# EAGLE design wakeel125 (EAGLE 7.5.0)
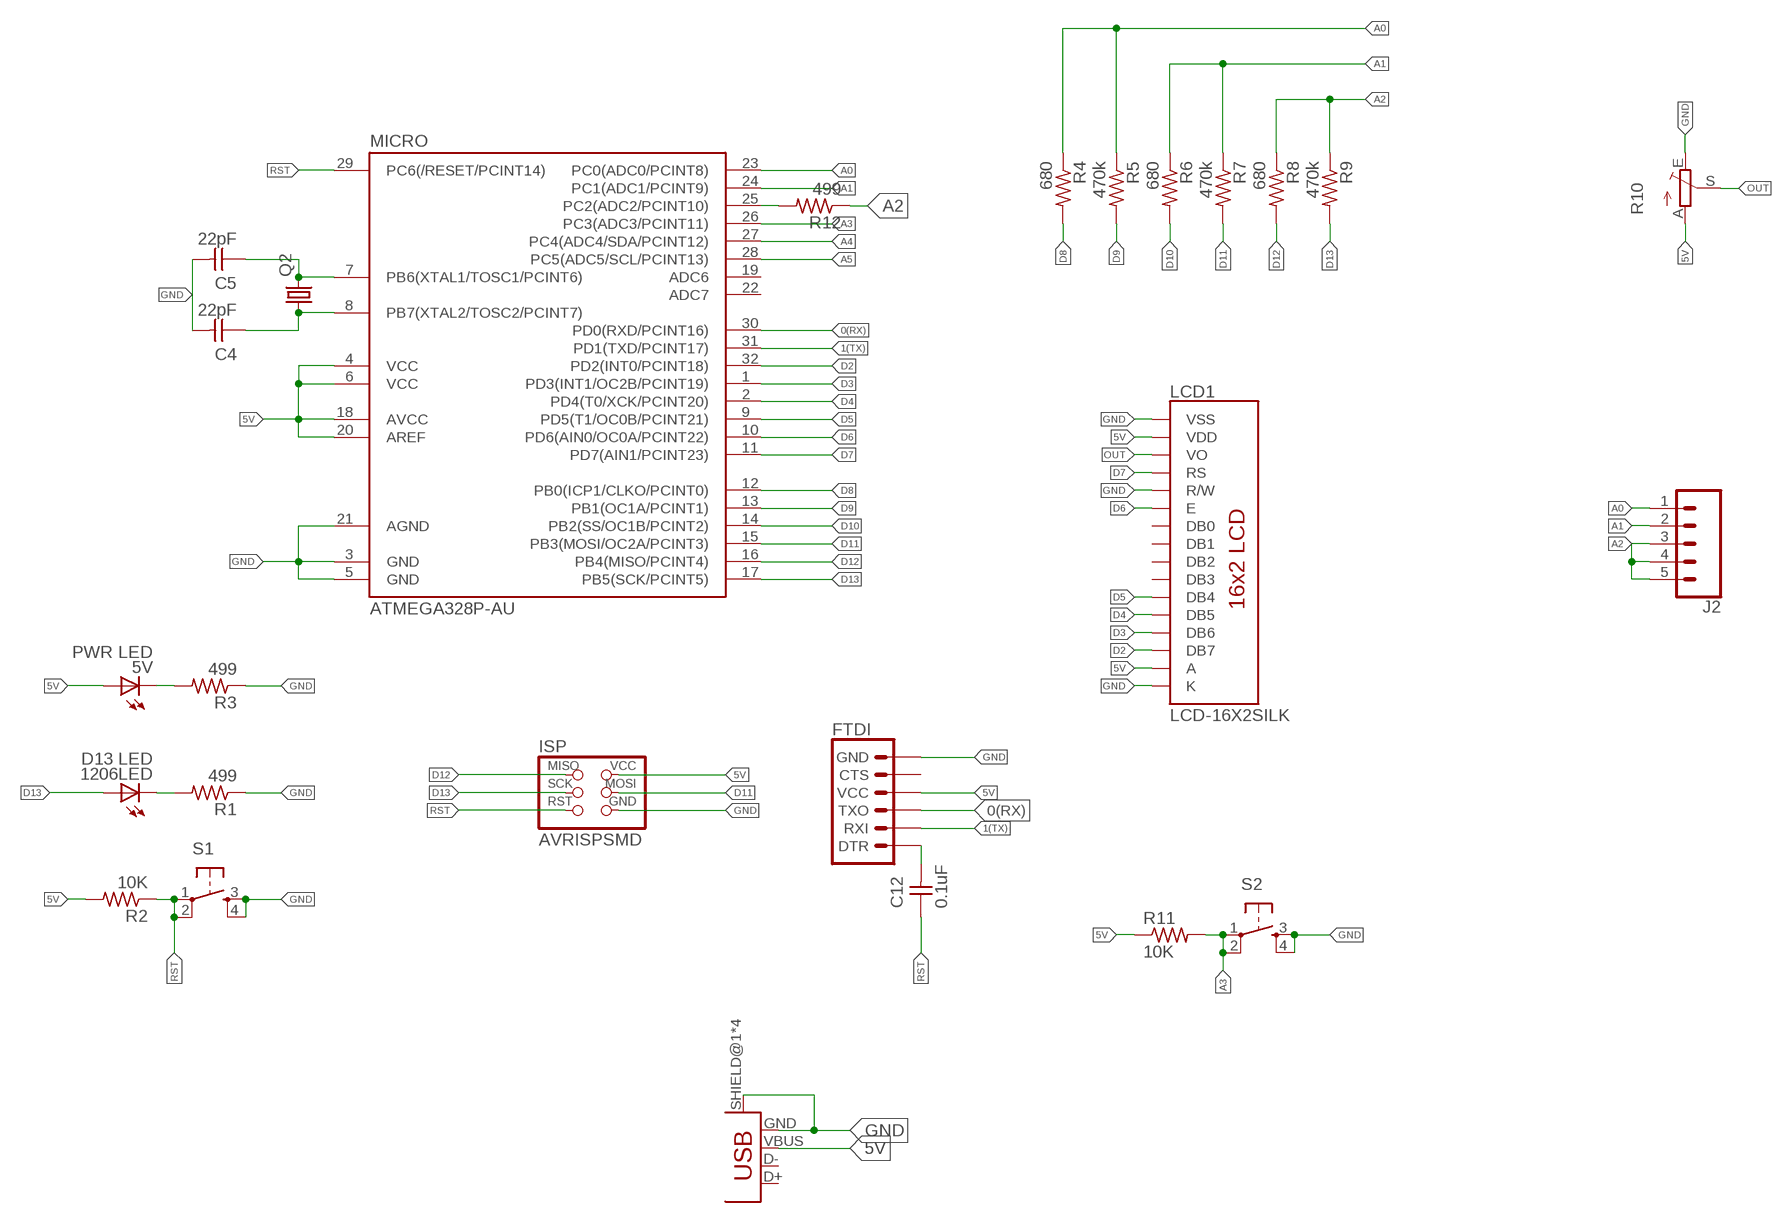
[diagram p0: schematic, sheet 1]

## Parts
5V  PWR LED  LEDFAB1206  [LED1206FAB]
1206LED  D13 LED  LEDFAB1206  [LED1206FAB]
C4  22pF  CAP-UNPOLARIZEDFAB  [C1206FAB]
C5  22pF  CAP-UNPOLARIZEDFAB  [C1206FAB]
C12  0.1uF  CAP-UNPOLARIZEDFAB  [C1206FAB]
CN1  USB_MINIB  [USB_MINIB]
FTDI  6_PIN_SERIAL_TARGET_SILK  [1X06]
ISP  AVRISPSMD  [2X03SMD]
J2  CONN_05  [1X05]
LCD1  LCD-16X2SILK  [LCD-16X2]
MICRO  ATMEGA328P-AU  ATMEGA48/88/168-AU  [TQFP32-08]
Q2  CRYSTALHC49U70  [HC49U70]
R1  499  RES-US1206FAB  [R1206FAB]
R2  10K  RES-US1206FAB  [R1206FAB]
R3  499  RES-US1206FAB  [R1206FAB]
R4  680  RES-US1206FAB  [R1206FAB]
R5  470k  RES-US1206FAB  [R1206FAB]
R6  680  RES-US1206FAB  [R1206FAB]
R7  470k  RES-US1206FAB  [R1206FAB]
R8  680  RES-US1206FAB  [R1206FAB]
R9  470k  RES-US1206FAB  [R1206FAB]
R10  TRIM_EU-B64W  [B64W]
R11  10K  RES-US1206FAB  [R1206FAB]
R12  499  RES-US1206FAB  [R1206FAB]
S1  6MM_SWITCH6MM_SWITCH  [6MM_SWITCH]
S2  6MM_SWITCH6MM_SWITCH  [6MM_SWITCH]

## Nets
0(RX): FTDI.3(TXO) MICRO.30(PD0(RXD/PCINT16))
1(TX): FTDI.2(RXI) MICRO.31(PD1(TXD/PCINT17))
5V: 5V.1(A) CN1.VBUS FTDI.4(VCC) ISP.2(VCC) LCD1.2(VDD) LCD1.15(A) MICRO.4(VCC) MICRO.6(VCC) MICRO.18(AVCC) MICRO.20(AREF) R2.2 R10.A R11.1
A0: J2.1 MICRO.23(PC0(ADC0/PCINT8)) R4.1 R5.1
A1: J2.2 MICRO.24(PC1(ADC1/PCINT9)) R6.1 R7.1
A2: J2.3 J2.4 J2.5 R8.1 R9.1 R12.1
A3: MICRO.26(PC3(ADC3/PCINT11)) R11.2 S2.1(P) S2.2(P1)
A4: MICRO.27(PC4(ADC4/SDA/PCINT12))
A5: MICRO.28(PC5(ADC5/SCL/PCINT13))
D2: LCD1.14(DB7) MICRO.32(PD2(INT0/PCINT18))
D3: LCD1.13(DB6) MICRO.1(PD3(INT1/OC2B/PCINT19))
D4: LCD1.12(DB5) MICRO.2(PD4(T0/XCK/PCINT20))
D5: LCD1.11(DB4) MICRO.9(PD5(T1/OC0B/PCINT21))
D6: LCD1.6(E) MICRO.10(PD6(AIN0/OC0A/PCINT22))
D7: LCD1.4(RS) MICRO.11(PD7(AIN1/PCINT23))
D8: MICRO.12(PB0(ICP1/CLKO/PCINT0)) R4.2
D9: MICRO.13(PB1(OC1A/PCINT1)) R5.2
D10: MICRO.14(PB2(SS/OC1B/PCINT2)) R6.2
D11: ISP.4(MOSI) MICRO.15(PB3(MOSI/OC2A/PCINT3)) R7.2
D12: ISP.1(MISO) MICRO.16(PB4(MISO/PCINT4)) R8.2
D13: 1206LED.1(A) ISP.3(SCK) MICRO.17(PB5(SCK/PCINT5)) R9.2
GND: C4.2 C5.2 CN1.GND CN1.SHIELD@1(SHIELD) CN1.SHIELD@2(SHIELD) CN1.SHIELD@3(SHIELD) CN1.SHIELD@4(SHIELD) FTDI.6(GND) ISP.6(GND) LCD1.1(VSS) LCD1.5(R/W) LCD1.16(K) MICRO.3(GND) MICRO.5(GND) MICRO.21(AGND) R1.1 R3.1 R10.E S1.3(S) S1.4(S1) S2.3(S) S2.4(S1)
N$1: 1206LED.2(C) R1.2
N$2: 5V.2(C) R3.2
N$3: C5.1 MICRO.7(PB6(XTAL1/TOSC1/PCINT6)) Q2.2
N$4: C4.1 MICRO.8(PB7(XTAL2/TOSC2/PCINT7)) Q2.1
N$5: MICRO.25(PC2(ADC2/PCINT10)) R12.2
N$16: C12.2 FTDI.1(DTR)
OUT: LCD1.3(VO) R10.S
RST: C12.1 ISP.5(RST) MICRO.29(PC6(/RESET/PCINT14)) R2.1 S1.1(P) S1.2(P1)
Unconnected: CN1.D+ CN1.D- FTDI.5(CTS) LCD1.7(DB0) LCD1.8(DB1) LCD1.9(DB2) LCD1.10(DB3) MICRO.19(ADC6) MICRO.22(ADC7)

## Library data of the parts
5V 1206LED = fab:LED: LED
C4 C5 C12 = fab:CAP-UNPOLARIZED
CN1 = fab:USB_MINIB
FTDI = SparkFun-Connectors:6_PIN_SERIAL_TARGET: 6-pin header connection for use with the "FTDI BASIC" pinout - TARGET SIDE. Also known as "Arduino Serial Program Header". It is used to mate with our FTDI Basic serial programmers using the Arduino IDE. Note, this device has "TARGET" in the name. It is intended to be used on a design that contains a target micro-controller that you wish to program. The "sister" device, named "CABLE" is inteneded to be used on a design that usually lives on the end of your USB cable and prvides the converter chip (FTDI232 or FTDI231x) to commnicate serial RX/TX. You can populate with some of these: Break Away Headers - Straight <https://www.sparkfun.com/products/116> (PRT-00116) For reference (or to suit your programming needs) check out these designs: SparkFun FTDI Basic Breakout - 5V <https://www.sparkfun.com/products/9716> (DEV-09716) SparkFun FTDI Basic Breakout - 3.3V <https://www.sparkfun.com/products/9873> (DEV-09873) SparkFun FTDI SmartBasic <https://www.sparkfun.com/products/12935> (DEV-12935) SparkFun Beefy 3 - FTDI Basic Breakout <https://www.sparkfun.com/products/13746> (DEV-13746)
ISP = fab:AVRISP
J2 = SparkFun-Connectors:CONN_05: Multi connection point. Often used as Generic Header-pin footprint for 0.1 inch spaced/style header connections On any of the 0.1 inch spaced packages, you can populate with these: Break Away Headers - Straight <https://www.sparkfun.com/products/116> (PRT-00116) Break Away Male Headers - Right Angle <https://www.sparkfun.com/products/553> (PRT-00553) Female Headers <https://www.sparkfun.com/products/115> (PRT-00115) Break Away Headers - Machine Pin <https://www.sparkfun.com/products/117> (PRT-00117) Break Away Female Headers - Swiss Machine Pin <https://www.sparkfun.com/products/743> (PRT-00743) For SCREWTERMINALS and SPRING TERMINALS visit here: Screw Terimnals on SparkFun.com <https://www.sparkfun.com/search/results?term=Screw+Terminals> (5mm/3.5mm/2.54mm spacing) This device is also useful as a general connection point to wire up your design to another part of your project. Our various solder wires solder well into these plated through hole pads. Hook-Up Wire - Assortment (Stranded, 22 AWG) <https://www.sparkfun.com/products/11375> (PRT-11375) Hook-Up Wire - Assortment (Solid Core, 22 AWG) <https://www.sparkfun.com/products/11367> (PRT-11367) View the entire wire category on our website here <https://www.sparkfun.com/categories/141> Special notes: Molex polarized connector foot print use with SKU : PRT-08231 with associated crimp pins and housings. 1MM SMD Version SKU: PRT-10208
LCD1 = SparkFun-Displays:LCD-16X2: Standard text-only 16x2 parallel input LCD Basic 16 character by 2 line display. Typically utilizes the extremely common HD44780 parallel interface chipset SparkFun Products: Basic 16x2 Green <https://www.sparkfun.com/products/255> Basic 8x2 Green <https://www.sparkfun.com/products/11122>; SF_ID: LCD-00255
MICRO = atmega8:ATMEGA48/88/168
Q2 = crystal:CRYSTAL: CRYSTAL; OC_FARNELL: unknown; OC_NEWARK: unknown
R1-R9 R11 R12 = fab:RES-US: Resistor (US Symbol) Variants with postfix FAB are widened to allow the routing of internal traces
R10 = pot:TRIM_EU-: POTENTIOMETER
S1 S2 = fab:6MM_SWITCH: OMRON SWITCH

## Board
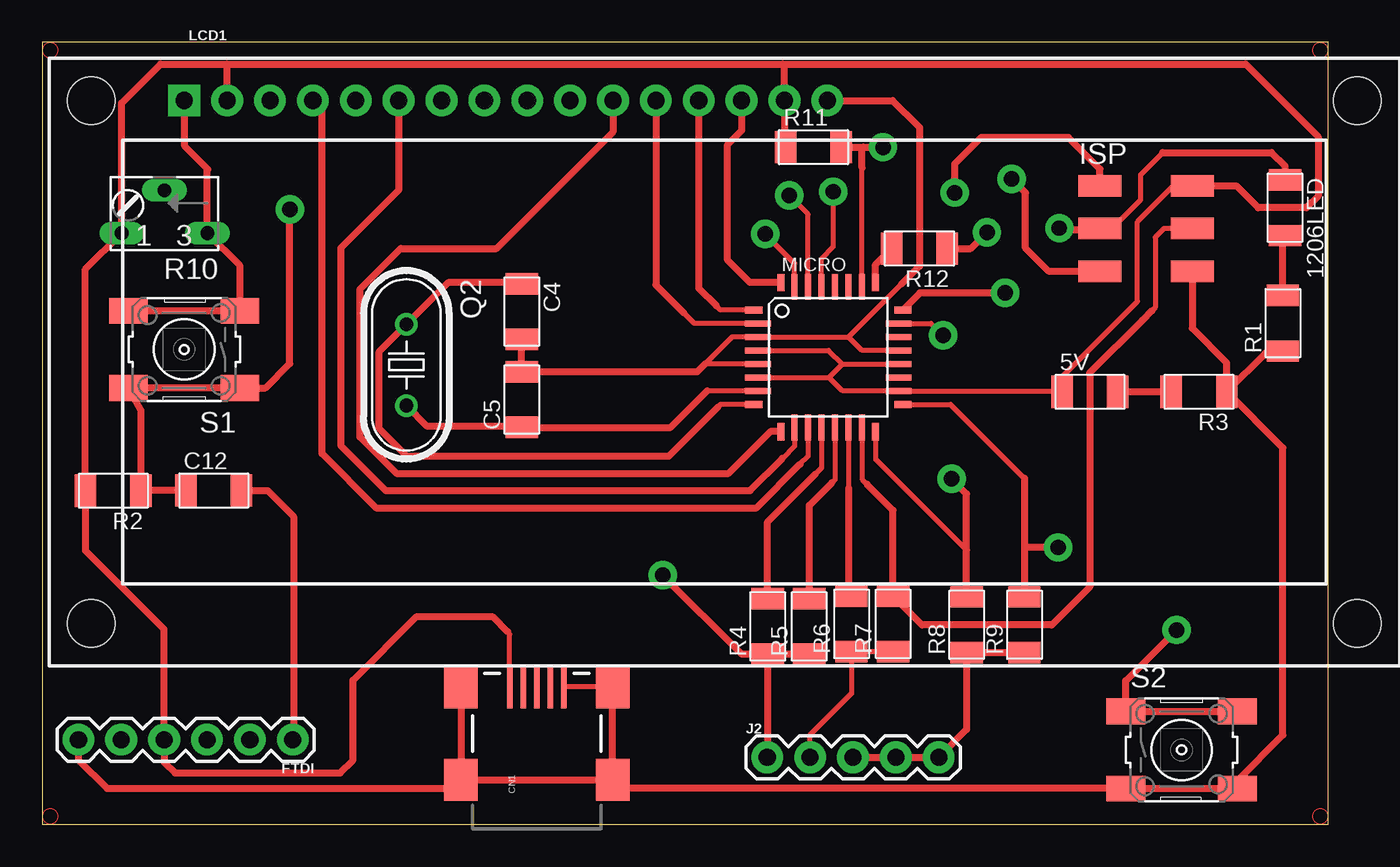
[diagram p1: board, top side]
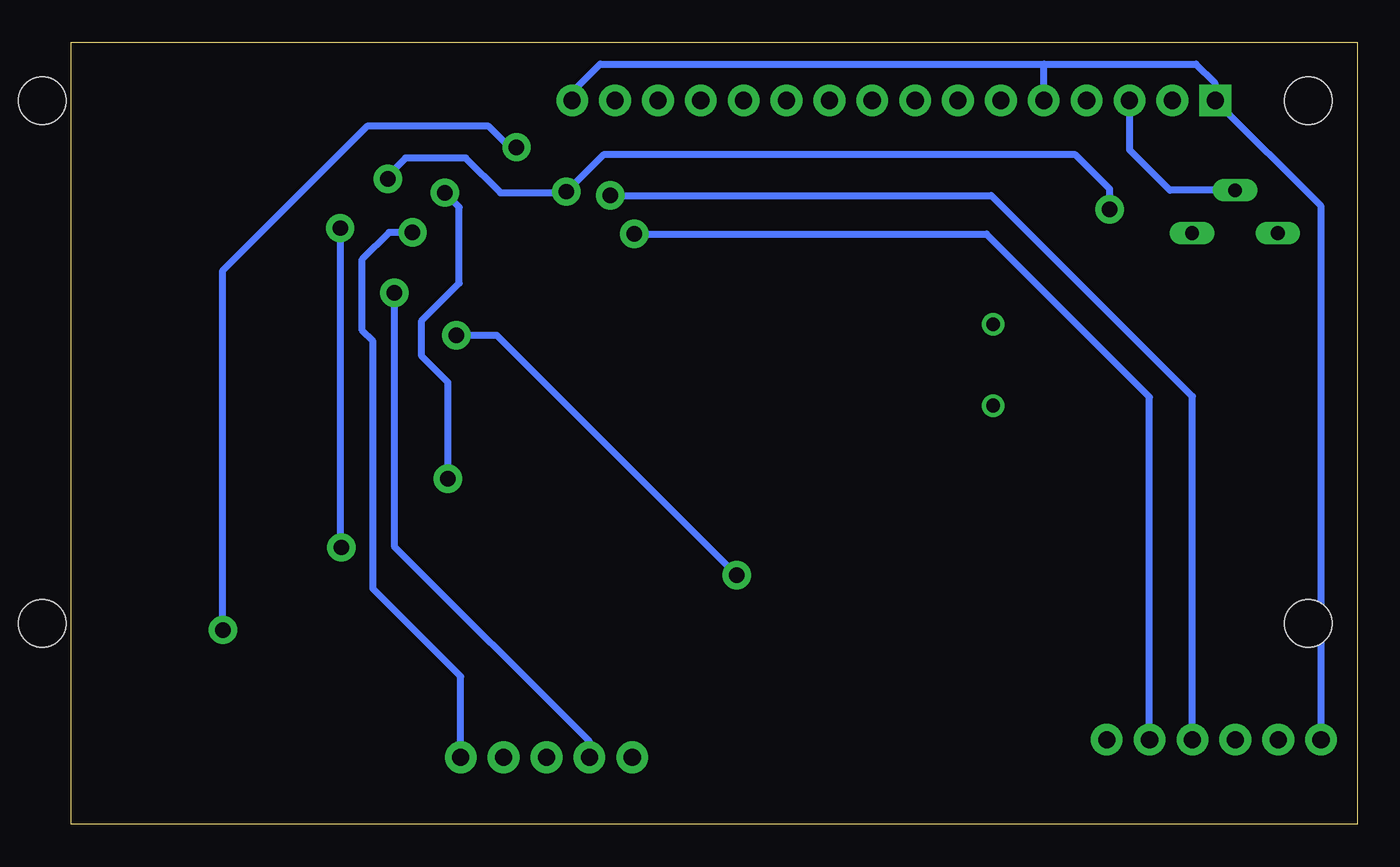
[diagram p2: board, bottom side, seen from below]

Size 76.2 x 46.35 mm. Coordinates in mm from the lower left corner, seen from the top.
Outline: 0,0 76.2,0 76.2,46.35 0,46.35 0,0
Copper layers (1*16): Top 0.035mm / dielectric 1.5mm / Bottom 0.035mm
Design rules "default *": minimum track width 10mil, minimum drill 24mil, track to track 12mil, track to pad 12mil, pad to pad 12mil, via to via 12mil, smd to smd 12mil, copper to edge 40mil, drill to drill 8mil, minimum pad ring 10mil, minimum via ring 8mil, stop-mask expansion 4mil, vias tented up to drill 0mil, thermal gap 10mil

### Footprints (pad centres in the part's own frame; a part is rotated, then mirrored left to right if it is on the bottom)
LED1206FAB = smd 1.27 x 1.905: 1 -1.651,0; 2 1.651,0
C1206FAB = smd 1.27 x 1.905: 1 -1.651,0; 2 1.651,0
USB_MINIB = smd 2.5 x 0.35: D+ 3.77,0; D- 3.77,0.8; GND 3.77,-1.6; ID 3.77,-0.8; VBUS 3.77,1.6 | smd 2.5 x 2: SHIELD@1 -1.73,-4.5; SHIELD@2 -1.73,4.5; SHIELD@3 3.77,4.5; SHIELD@4 3.77,-4.5
1X06 = drill 1.016 pad 1.88: 1 0,0; 2 2.54,0; 3 5.08,0; 4 7.62,0; 5 10.16,0; 6 12.7,0
2X03SMD = smd 2.54 x 1.27: 1 -2.54,2.54; 2 2.92,2.54; 3 -2.54,0; 4 2.92,0; 5 -2.54,-2.54; 6 2.92,-2.54
1X05 = drill 1.016 pad 1.88: 1 0,0; 2 2.54,0; 3 5.08,0; 4 7.62,0; 5 10.16,0
LCD-16X2 = drill 1.016 pad 1.88 square: 1 -32,15.5 | drill 1.016 pad 1.88: 2 -29.46,15.5; 3 -26.92,15.5; 4 -24.38,15.5; 5 -21.84,15.5; 6 -19.3,15.5; 7 -16.76,15.5; 8 -14.22,15.5; 9 -11.68,15.5; 10 -9.14,15.5; 11 -6.6,15.5; 12 -4.06,15.5; 13 -1.52,15.5; 14 1.02,15.5; 15 3.56,15.5; 16 6.1,15.5 | hole 2.8: -37.5,15.5; -37.5,-15.5; 37.5,15.5; 37.5,-15.5
TQFP32-08 = smd 1.016 x 0.406: 1 -4.42,2.8; 8 -4.42,-2.8; 17 4.42,-2.8; 24 4.42,2.8 | smd 1.524 x 0.356: 2 -4.166,2; 3 -4.166,1.2; 4 -4.166,0.4; 5 -4.166,-0.4; 6 -4.166,-1.2; 7 -4.166,-2; 18 4.166,-2; 19 4.166,-1.2; 20 4.166,-0.4; 21 4.166,0.4; 22 4.166,1.2; 23 4.166,2 | smd 0.406 x 1.016: 9 -2.8,-4.42; 16 2.8,-4.42; 25 2.8,4.42; 32 -2.8,4.42 | smd 0.356 x 1.524: 10 -2,-4.166; 11 -1.2,-4.166; 12 -0.4,-4.166; 13 0.4,-4.166; 14 1.2,-4.166; 15 2,-4.166; 26 2,4.166; 27 1.2,4.166; 28 0.4,4.166; 29 -0.4,4.166; 30 -1.2,4.166; 31 -2,4.166
HC49U70 = drill 0.813: 1 -2.413,0; 2 2.413,0
R1206FAB = smd 1.27 x 1.905: 1 -1.651,0; 2 1.651,0
B64W = drill 0.813 long: A 2.54,0; E -2.54,0; S 0,-2.54
6MM_SWITCH = smd 2.286 x 1.524: 1 -3.302,2.286; 2 3.302,2.286; 3 -3.302,-2.286; 4 3.302,-2.286

### Placement (x,y rotation side)
5V  62.08,25.64 0 top
1206LED  73.64,36.54 270 top
C4  28.41,30.39 270 top
C5  28.41,25.18 90 top
C12  10.16,19.78 0 top
CN1  29.31,4.37 90 top
FTDI  14.85,5.02 180 top
ISP  65.21,35.31 0 top
J2  42.96,3.97 0 top
LCD1  40.42,27.4 0 top
MICRO  46.58,27.69 0 top
Q2  21.58,27.23 270 top
R1  73.51,29.7 90 top
R2  4.21,19.77 180 top
R3  68.53,25.64 180 top
R4  42.98,11.73 90 top
R5  45.44,11.73 90 top
R6  47.95,11.88 90 top
R7  50.41,11.88 90 top
R8  54.77,11.83 90 top
R9  58.2,11.83 90 top
R10  7.25,35.04 180 top
R11  45.7,40.14 0 top
R12  51.97,34.13 180 top
S1  8.41,28.15 180 top
S2  67.51,4.41 0 top

### Tracks (layer width: path | path; a pad name or v marks a point on that pad's centre or on a via)
0(RX)  (via drill 0.91 pad 1.68)
  Top 0.305: MICRO.30 45.38,36.16 v44.26,37.27
  Bottom 0.406: FTDI.3 9.77,25.36 21.68,37.27 v44.26,37.27
1(TX)  (via drill 0.91 pad 1.68)
  Top 0.305: MICRO.31 44.58,33.24 v42.83,34.99
  Bottom 0.406: FTDI.2 12.31,25.32 21.97,34.99 v42.83,34.99
5V
  Top 0.305: MICRO.4 46.59,28.09 47.4,27.27 | 47.4,27.27 50.72,27.27 MICRO.20 | MICRO.6 46.62,26.49 | 46.62,26.49 47.4,27.27 | 46.62,26.49 47.42,25.69 MICRO.18 60.38,25.69 5V.1 60.43,26.52 64.9,30.99 64.9,35.72 66.99,37.81 68.1,37.81 | CN1.VBUS 27.7,11.28 27.57,11.41
  Top 0.406: 10.95,45.05 7.02,45.05 4.71,42.74 R10.A | 10.95,45.05 43.88,45.05 | 43.88,45.05 71.31,45.05 75.6,40.77 75.6,37.24 74.9,36.54 72.04,36.54 70.74,37.85 ISP.2 68.1,37.81 | 4.58,35.04 R10.A | R10.A 2.56,32.89 R2.2 2.56,16.23 7.23,11.57 FTDI.4 7.23,3.69 7.87,3.05 17.65,3.05 18.41,3.81 18.41,8.54 22.19,12.32 26.67,12.32 27.57,11.41 | LCD1.2 10.96,45.05 10.95,45.05 | 43.88,45.05 43.98,44.95 LCD1.15 43.98,40.2 R11.1
A0  (via drill 0.91 pad 1.68)
  Top 0.305: MICRO.23 52.67,29.69 v53.37,28.99
  Top 0.406: J2.1 42.98,6.28 R4.1 R5.1 41.45,10.08 v36.77,14.76
  Bottom 0.406: v53.37,28.99 50.99,28.99 v36.77,14.76
A1  (via drill 0.91 pad 1.68)
  Top 0.305: R7.1 R6.1 47.95,7.76 45.5,5.3 J2.2
  Top 0.406: v57.05,31.5 52,31.5 MICRO.24
  Bottom 0.406: v57.05,31.5 57.05,16.48 45.5,4.92 J2.2
A2  (via drill 0.91 pad 1.68)
  Top 0.406: J2.3 J2.4 J2.5 54.77,5.62 R8.1 R9.1 | R12.1 55.02,34.13 v55.98,35.08
  Bottom 0.406: J2.5 53.12,8.76 58.33,13.97 58.33,28.64 58.96,29.27 58.96,33.5 57.37,35.08 v55.98,35.08
A3  (via drill 0.91 pad 1.68)
  Top 0.305: MICRO.26 48.58,38.91
  Top 0.406: S2.2 S2.1 64.2,8.51 v67.22,11.53 | R11.2 48.64,40.14 | 48.64,40.14 v49.81,40.14 v49.82,40.13 | 48.58,38.91 48.58,40.07 48.64,40.14
  Bottom 0.406: v67.22,11.53 67.22,32.83 58.67,41.37 51.47,41.37 50.23,40.13 v49.82,40.13
D2
  Top 0.406: LCD1.14 41.44,41.12 40.61,40.29 40.61,33.43 41.93,32.11 MICRO.32
D3
  Top 0.305: MICRO.1 40.19,30.49 39.94,30.73
  Top 0.406: LCD1.13 38.9,31.78 39.94,30.73
D4
  Top 0.305: MICRO.2 38.64,29.69 37.67,30.66
  Top 0.406: LCD1.12 36.36,31.97 37.67,30.66 38.01,30.32
D5
  Top 0.406: MICRO.9 43.15,23.27 40.67,20.8 20.99,20.8 18.83,22.95 18.83,31.72 21.24,34.13 26.92,34.13 33.82,41.02 LCD1.11
D6
  Top 0.305: MICRO.10 44.58,22.41 43.85,21.68 43.47,21.3
  Top 0.406: 43.85,21.68 41.94,19.78 20.35,19.78 17.68,22.45 17.68,34.16 21.12,37.6 LCD1.6
D7
  Top 0.305: MICRO.11 45.38,21.82 44.91,21.35
  Top 0.406: 44.91,21.35 42.32,18.76 19.78,18.76 16.57,21.97 16.57,42.36 LCD1.4
D8
  Top 0.305: MICRO.12 46.18,21.12 45.8,20.75 44.74,19.68
  Top 0.406: R4.2 42.98,17.93 45.8,20.75
D9
  Top 0.305: MICRO.13 46.98,20.43 46.78,20.24 45.88,19.34
  Top 0.406: 45.37,13.46 R5.2 | 45.5,13.44 R5.2 | R5.2 45.45,18.9 46.78,20.24
D10
  Top 0.305: MICRO.14 47.78,19.91
  Top 0.406: 47.78,19.91 47.78,13.71 R6.2
D11
  Top 0.305: MICRO.15 48.58,20.45 48.88,20.14 | ISP.4 66.46,35.31 65.94,34.8 65.94,30.64 65.17,29.86 | 59.85,11.78 59.82,11.81
  Top 0.406: 48.88,20.14 50.41,18.61 R7.2 52.14,11.81 59.82,11.81 62.07,14.06 62.07,26.77 65.17,29.86 65.75,30.45
D12  (via drill 0.91 pad 1.68)
  Top 0.305: 54.77,16.26 49.38,21.65 MICRO.16
  Top 0.406: v53.88,20.48 54.77,19.59 54.77,16.26 R8.2 | ISP.1 62.67,38.83 60.8,40.7 55.63,40.7 54.07,39.15 v54.07,37.43
  Bottom 0.406: 54.45,37.4 v54.07,37.43 53.21,36.58 53.21,32.07 55.44,29.84 55.44,27.75 53.88,26.19 v53.88,20.48
D13  (via drill 0.91 pad 1.68)
  Top 0.305: 58.2,20.51 53.82,24.89 MICRO.17 | 66.39,39.81 65.09,38.51 65.09,37.02 63.38,35.31 ISP.3
  Top 0.406: 66.39,39.81 72.83,39.81 73.64,39.01 1206LED.1 | ISP.3 62.58,35.21 60.39,35.21 v60.26,35.34 | 58.2,20.51 58.2,16.41 | 58.2,16.41 R9.2 | v60.2,16.41 58.2,16.41
  Bottom 0.406: v60.26,35.34 60.26,16.48 v60.2,16.41
GND
  Top 0.305: 47.78,28.89 MICRO.3 40.88,28.89 39.27,27.29 MICRO.5 | 50.93,32.04 47.78,28.89 | MICRO.21 48.58,28.09 47.78,28.89 | CN1.SHIELD@4 CN1.GND
  Top 0.406: 28.29,26.45 C5.2 | R1.1 73.37,27.91 72.46,27.91 R3.1 | 4.39,30.57 S1.4 S1.3 11.72,33.11 R10.E 9.79,38.81 9.81,38.83 8.42,40.22 LCD1.1 | R3.1 73.51,22.31 73.51,5.3 70.81,2.59 S2.4 S2.3 34.31,2.13 CN1.SHIELD@1 | R3.1 70.19,27.35 68.13,29.4 ISP.6 | C5.2 C4.2 | C5.2 38.81,26.83 39.27,27.29 | 50.93,32.04 51.98,33.08 51.98,41.31 50.38,42.9 LCD1.16 | CN1.SHIELD@1 CN1.SHIELD@4 | CN1.SHIELD@2 CN1.SHIELD@1 | CN1.SHIELD@3 CN1.SHIELD@2 | FTDI.6 2.15,3.82 3.84,2.13 24.3,2.13 CN1.SHIELD@2
  Bottom 0.406: 18.54,45.05 44.86,45.05 46.52,43.4 LCD1.16 | 18.54,45.05 9.56,45.05 8.42,43.91 LCD1.1 2.15,36.63 FTDI.6 | LCD1.5 18.58,45.02 18.54,45.05
N$1
  Top 0.406: R1.2 73.51,34.77 1206LED.2
N$2
  Top 0.406: 5V.2 R3.2
N$3
  Top 0.305: MICRO.7 39.4,25.69
  Top 0.406: C5.1 28.35,23.59 22.8,23.59 Q2.2 | 28.48,23.59 C5.1 | C5.1 37.24,23.53 39.4,25.69
N$4
  Top 0.305: MICRO.8 40.19,24.89 40.04,24.73
  Top 0.406: C4.1 28.36,32.1 24.03,32.1 Q2.1 19.97,28.04 19.97,23.46 21.62,21.81 37.12,21.81 40.04,24.73
N$5
  Top 0.406: MICRO.25 49.38,33.18 R12.2
N$16
  Top 0.406: C12.2 13.37,19.78 14.89,18.26 14.89,5.06 FTDI.1
OUT
  Bottom 0.406: LCD1.3 13.5,39.98 11.1,37.58 R10.S
RST  (via drill 0.91 pad 1.68)
  Top 0.305: v46.86,37.5 46.86,34.23 46.18,33.54 MICRO.29
  Top 0.406: S1.2 S1.1 13.23,25.86 14.67,27.3 v14.67,36.45 | S1.2 4.35,25.69 | C12.1 5.87,19.78 R2.1 5.86,24.53 S1.2 | ISP.5 59.66,32.77 58.26,34.16 58.26,37.43 v57.44,38.26
  Bottom 0.406: v14.67,36.45 14.67,37.66 16.7,39.69 44.67,39.69 v46.86,37.5 46.93,37.43 50.77,37.43 52.83,39.5 56.39,39.5 57.44,38.45 v57.44,38.26
(copper drawn outside any net)
  shapes: Top circle x4